# EAGLE schematic bbstghs_wlan (EAGLE 5.09)
POLLIN: AC-1205G
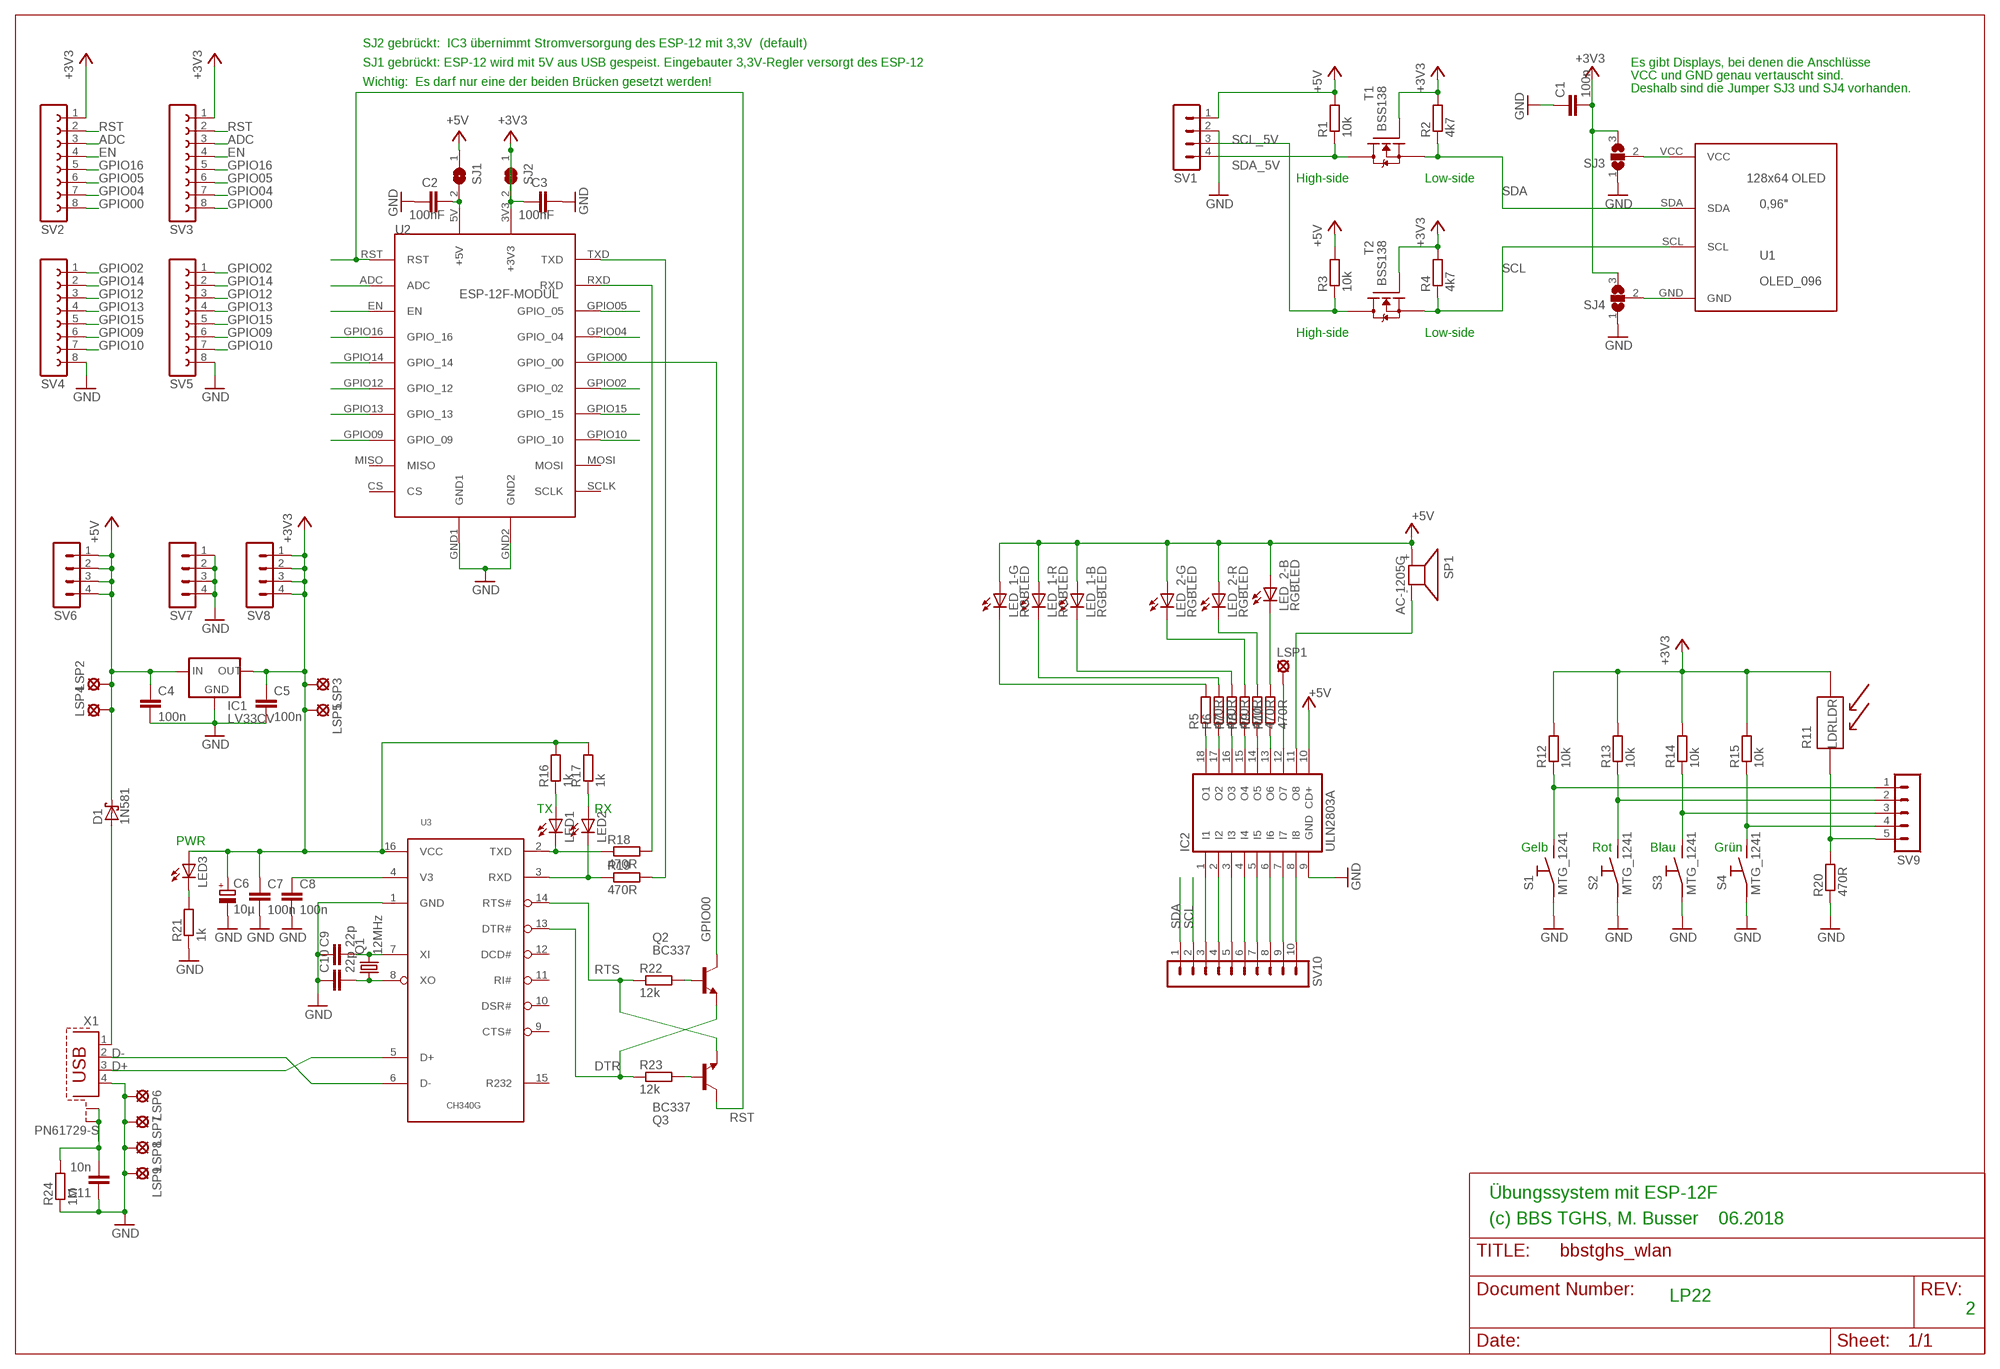
[diagram p0: schematic, sheet 1]

## Parts
C1  100n  C-EU050-030X075  [C050-030X075]
C2  100nF  C-EU050-030X075  [C050-030X075]
C3  100nF  C-EU050-030X075  [C050-030X075]
C4  100n  C-EU050-030X075  [C050-030X075]
C5  100n  C-EU050-030X075  [C050-030X075]
C6  10µ  CPOL-EUE2.5-6  [E2,5-6]
C7  100n  C-EU050-030X075  [C050-030X075]
C8  100n  C-EU050-030X075  [C050-030X075]
C9  22p  C-EU025-025X050  [C025-025X050]
C10  22p  C-EU025-025X050  [C025-025X050]
C11  10n  C-EU025-025X050  [C025-025X050]
D1  1N581  [DO41-10]
IC1  LV33CV  78XXS  [78XXS]
IC2  ULN2803A  [DIL18]
LED1  LED3MM  [LED3MM]
LED2  LED3MM  [LED3MM]
LED3  LED3MM  [LED3MM]
LED_1  RGBLED  [RGBLED]
LED_2  RGBLED  [RGBLED]
LSP1  LSP13  [LSP13]
LSP2  LSP10  [LSP10]
LSP3  LSP10  [LSP10]
LSP4  LSP10  [LSP10]
LSP5  LSP10  [LSP10]
LSP6  LSP10  [LSP10]
LSP7  LSP10  [LSP10]
LSP8  LSP10  [LSP10]
LSP9  LSP10  [LSP10]
Q1  12MHz  CRYSTALHC49S  [HC49/S]
Q2  BC337  [TO92]
Q3  BC337  [TO92]
R1  10k  R-EU_R1206  [R1206]
R2  4k7  R-EU_R1206  [R1206]
R3  10k  R-EU_R1206  [R1206]
R4  4k7  R-EU_R1206  [R1206]
R5  470R  R-EU_0207/10  [0207/10]
R6  470R  R-EU_0207/10  [0207/10]
R7  470R  R-EU_0207/10  [0207/10]
R8  470R  R-EU_0207/10  [0207/10]
R9  470R  R-EU_0207/10  [0207/10]
R10  470R  R-EU_0207/10  [0207/10]
R11  LDRLDR  [LDR]
R12  10k  R-EU_0207/10  [0207/10]
R13  10k  R-EU_0207/10  [0207/10]
R14  10k  R-EU_0207/10  [0207/10]
R15  10k  R-EU_0207/10  [0207/10]
R16  1k  R-EU_0207/10  [0207/10]
R17  1k  R-EU_0207/10  [0207/10]
R18  470R  R-EU_0207/10  [0207/10]
R19  470R  R-EU_0207/10  [0207/10]
R20  470R  R-EU_0207/10  [0207/10]
R21  1k  R-EU_0207/10  [0207/10]
R22  12k  R-EU_0207/10  [0207/10]
R23  12k  R-EU_0207/10  [0207/10]
R24  1M  R-EU_0204/2V  [0204V]
S1  MTG_1241  [SCHURTER_MTG]
S2  MTG_1241  [SCHURTER_MTG]
S3  MTG_1241  [SCHURTER_MTG]
S4  MTG_1241  [SCHURTER_MTG]
SJ1  SJW  [SJW]
SJ2  SJW  [SJW]
SJ3  SJ2W  [SJ_2]
SJ4  SJ2W  [SJ_2]
SP1  AC-1205G  KSS1201  [KSS1201]
SV1  MA04-1  [MA04-1]
SV2  FE08-1  [FE08]
SV3  FE08-1  [FE08]
SV4  FE08-1  [FE08]
SV5  FE08-1  [FE08]
SV6  MA04-1  [MA04-1]
SV7  MA04-1  [MA04-1]
SV8  MA04-1  [MA04-1]
SV9  MA05-1  [MA05-1]
SV10  MA10-1  [MA10-1]
T1  BSS138  [SOT23]
T2  BSS138  [SOT23]
U1  OLED_096  [OLED_096]
U2  ESP-12F-MODUL  [ESP-12F_MODUL]
U3  CH340G  [SO16]
X1  PN61729-S  [PN61729-S]

## Nets
+3V3: C1.2 C3.1 C5.1 C6.+ C7.1 IC1.OUT LED3.A LSP3.MP LSP5.MP R2.2 R4.2 R11.P$1 R12.2 R13.2 R14.2 R15.2 R16.2 R17.2 SJ2.1 SJ2.2 SJ3.3 SJ4.3 SV2.1 SV3.1 SV8.1 SV8.2 SV8.3 SV8.4 T1.1(G) T2.1(G) U2.3V3(+3V3) U3.16(VCC)
+5V: C4.1 D1.C IC1.IN IC2.10(CD+) LED_1.4(-G:A) LED_1.5(-R:A) LED_1.6(-B:A) LED_2.4(-G:A) LED_2.5(-R:A) LED_2.6(-B:A) LSP2.MP LSP4.MP R1.2 R3.2 SJ1.1 SP1.+ SV1.1 SV6.1 SV6.2 SV6.3 SV6.4
ADC: SV2.3 SV3.3 U2.ADC
D+: U3.5(D+) X1.3
D-: U3.6(D-) X1.2
DTR: Q2.1(E) R23.1 U3.13(DTR#)
EN: SV2.4 SV3.4 U2.EN
GND: C1.1 C2.1 C3.2 C4.2 C5.2 C6.- C7.2 C8.2 C9.1 C10.1 C11.1 IC1.GND IC2.9(GND) LSP6.MP LSP7.MP LSP8.MP LSP9.MP R20.1 R21.1 R24.1 S1.P$1(C) S2.P$1(C) S3.P$1(C) S4.P$1(C) SJ3.1 SJ4.1 SV1.2 SV4.8 SV5.8 SV7.1 SV7.2 SV7.3 SV7.4 U2.GND1 U2.GND2 U3.1(GND) X1.4
GPIO00: Q2.3(C) SV2.8 SV3.8 U2.GPIO00(GPIO_00)
GPIO02: SV4.1 SV5.1 U2.GPIO02(GPIO_02)
GPIO04: SV2.7 SV3.7 U2.GPIO04(GPIO_04)
GPIO05: SV2.6 SV3.6 U2.GPIO05(GPIO_05)
GPIO09: SV4.6 SV5.6 U2.GPIO09(GPIO_09)
GPIO10: SV4.7 SV5.7 U2.GPIO10(GPIO_10)
GPIO12: SV4.3 SV5.3 U2.GPIO12(GPIO_12)
GPIO13: SV4.4 SV5.4 U2.GPIO13(GPIO_13)
GPIO14: SV4.2 SV5.2 U2.GPIO14(GPIO_14)
GPIO15: SV4.5 SV5.5 U2.GPIO15(GPIO_15)
GPIO16: SV2.5 SV3.5 U2.GPIO16(GPIO_16)
N$1: C9.2 Q1.2 U3.7(XI)
N$2: C10.2 Q1.1 U3.8(XO)
N$3: LED3.K(C) R21.2
N$4: Q3.2(B) R23.2
N$5: Q2.2(B) R22.2
N$6: C8.1 U3.4(V3)
N$7: LED1.A R16.1
N$8: LED2.A R17.1
N$9: R18.2 U2.RXD
N$10: R19.2 U2.TXD
N$11: C2.2 SJ1.2 U2.5V(+5V)
N$12: SJ4.2 U1.GND
N$13: D1.A X1.1
N$14: IC2.18(O1) R5.1
N$15: IC2.17(O2) R6.1
N$16: LED2.K(C) R19.1 U3.3(RXD)
N$17: C11.2 R24.2 X1.S1 X1.S2
N$18: IC2.16(O3) R7.1
N$19: LED_1.1(-G:C) R5.2
N$20: LED1.K(C) R18.1 U3.2(TXD)
N$21: LED_1.2(-R:C) R6.2
N$22: IC2.15(O4) R8.1
N$23: IC2.14(O5) R9.1
N$24: IC2.13(O6) R10.1
N$25: IC2.1(I1) SV10.3
N$26: IC2.2(I2) SV10.4
N$27: IC2.3(I3) SV10.5
N$28: IC2.4(I4) SV10.6
N$29: IC2.5(I5) SV10.7
N$30: IC2.6(I6) SV10.8
N$31: IC2.7(I7) SV10.9
N$32: IC2.8(I8) SV10.10
N$33: R12.1 S1.P$2(NO) SV9.1
N$34: R13.1 S2.P$2(NO) SV9.2
N$35: R14.1 S3.P$2(NO) SV9.3
N$36: R15.1 S4.P$2(NO) SV9.4
N$37: LED_1.3(-B:C) R7.2
N$38: LED_2.1(-G:C) R8.2
N$39: LED_2.2(-R:C) R9.2
N$40: LED_2.3(-B:C) R10.2
N$41: IC2.11(O8) SP1.-
N$42: R11.P$2 R20.2 SV9.5
N$43: IC2.12(O7) LSP1.MP
N$44: SJ3.2 U1.VCC
RST: Q3.3(C) SV2.2 SV3.2 U2.RST
RTS: Q3.1(E) R22.1 U3.14(RTS#)
SCL: R4.1 SV10.2 T2.2(S) U1.SCL
SCL_5V: R3.1 SV1.3 T2.3(D)
SDA: R2.1 SV10.1 T1.2(S) U1.SDA
SDA_5V: R1.1 SV1.4 T1.3(D)
Unconnected: U2.CS U2.MISO U2.MOSI U2.SCLK U3.9(CTS#) U3.10(DSR#) U3.11(RI#) U3.12(DCD#) U3.15(R232)

## Notes on the sheet
- SJ2 gebrückt:  IC3 übernimmt Stromversorgung des ESP-12 mit 3,3V  (default)
- SJ1 gebrückt: ESP-12 wird mit 5V aus USB gespeist. Eingebauter 3,3V-Regler versorgt des ESP-12 | Es gibt Displays, bei denen die Anschlüsse
- VCC und GND genau vertauscht sind.
- Wichtig:  Es darf nur eine der beiden Brücken gesetzt werden!
- Deshalb sind die Jumper SJ3 und SJ4 vorhanden.
- High-side | Low-side
- High-side | Low-side
- TX | RX
- PWR
- Gelb | Rot | Blau | Grün
- Übungssystem mit ESP-12F
- (c) BBS TGHS, M. Busser    06.2018
- LP22
- 2

## Library data of the parts
C1-C5 C7-C11 = bbstghs:C-EU: CAPACITOR, European symbol
C6 = bbstghs:CPOL-EU: POLARIZED CAPACITOR, European symbol
D1 = bbstghs:1N581*: 1.0A SCHOTTKY BARRIER RECTIFIER Source: http://www.diodes.com/datasheets/ds23001.pdf
IC1 = v-reg-3:78XXS: VOLTAGE REGULATOR
IC2 = uln-udn:ULN2803A: DRIVER ARRAY
LED1-LED3 = bbstghs:LED: LED OSRAM: - CHIPLED LG R971, LG N971, LY N971, LG Q971, LY Q971, LO R971, LY R971 LH N974, LH R974 LS Q976, LO Q976, LY Q976 LO Q996 - Hyper CHIPLED LW Q18S LB Q993, LB Q99A, LB R99A - SideLED LS A670, LO A670, LY A670, LG A670, LP A670 LB A673, LV A673, LT A673, LW A673 LH A674 LY A675 LS A676, LA A676, LO A676, LY A676, LW A676 LS A679, LY A679, LG A679 - Hyper Micro SIDELED® LS Y876, LA Y876, LO Y876, LY Y876 LT Y87S - SmartLED LW L88C, LW L88S LB L89C, LB L89S, LG L890 LS L89K, LO L89K, LY L89K LS L896, LA L896, LO L896, LY L896 - TOPLED LS T670, LO T670, LY T670, LG T670, LP T670 LSG T670, LSP T670, LSY T670, LOP T670, LYG T670 LG T671, LOG T671, LSG T671 LB T673, LV T673, LT T673, LW T673 LH T674 LS T676, LA T676, LO T676, LY T676, LB T676, LH T676, LSB T676, LW T676 LB T67C, LV T67C, LT T67C, LS T67K, LO T67K, LY T67K, LW E67C LS E67B, LA E67B, LO E67B, LY E67B, LB E67C, LV E67C, LT E67C LW T67C LS T679, LY T679, LG T679 LS T770, LO T770, LY T770, LG T770, LP T770 LB T773, LV T773, LT T773, LW T773 LH T774 LS E675, LA E675, LY E675, LS T675 LS T776, LA T776, LO T776, LY T776, LB T776 LHGB T686 LT T68C, LB T68C - Hyper Mini TOPLED® LB M676 - Mini TOPLED Santana® LG M470 LS M47K, LO M47K, LY M47K Source: http://www.osram.convergy.de LUXEON: - LUMILED® LXK2-PW12-R00, LXK2-PW12-S00, LXK2-PW14-U00, LXK2-PW14-V00 LXK2-PM12-R00, LXK2-PM12-S00, LXK2-PM14-U00 LXK2-PE12-Q00, LXK2-PE12-R00, LXK2-PE12-S00, LXK2-PE14-T00, LXK2-PE14-U00 LXK2-PB12-K00, LXK2-PB12-L00, LXK2-PB12-M00, LXK2-PB14-N00, LXK2-PB14-P00, LXK2-PB14-Q00 LXK2-PR12-L00, LXK2-PR12-M00, LXK2-PR14-Q00, LXK2-PR14-R00 LXK2-PD12-Q00, LXK2-PD12-R00, LXK2-PD12-S00 LXK2-PH12-R00, LXK2-PH12-S00 LXK2-PL12-P00, LXK2-PL12-Q00, LXK2-PL12-R00 Source: www.luxeon.com KINGBRIGHT: KA-3528ASYC Source: www.kingbright.com
LED_1 LED_2 = bbstghs:RGBLED
LSP1 = solpad:LSP13: SOLDER PAD drill 1.3 mm, distributor Buerklin, 12H562
LSP2-LSP9 = solpad:LSP10: SOLDER PAD drill 1.0 mm, distributor Buerklin, 12H555
Q1 = bbstghs:CRYSTAL: CRYSTAL
Q2 Q3 = bbstghs:BC337*: NPN Transistor
R1-R10 R12-R24 = bbstghs:R-EU_: RESISTOR, European symbol
R11 = bbstghs:LDR
S1-S4 = bbstghs:MTG_1241: Reichelt TASTER 1022, TASTER 1032
SJ1 SJ2 = jumper:SJ: SMD solder JUMPER
SJ3 SJ4 = jumper:SJ2W: SMD solder JUMPER
SP1 = bbstghs:KSS1201: SPEAKER Source: Schukat
SV1 SV6-SV8 = con-lstb:MA04-1: PIN HEADER
SV2-SV5 = con-lsta:FE08-1: FEMALE HEADER
SV9 = con-lstb:MA05-1: PIN HEADER
SV10 = con-lstb:MA10-1: PIN HEADER
T1 T2 = bbstghs:BSS138
U1 = bbstghs:OLED_096
U2 = bbstghs:ESP-12F-MODUL
U3 = bbstghs:CH340G
X1 = bbstghs:PN61729-S: BERG USB connector